# Altium project PCB_CMV.PrjPCB
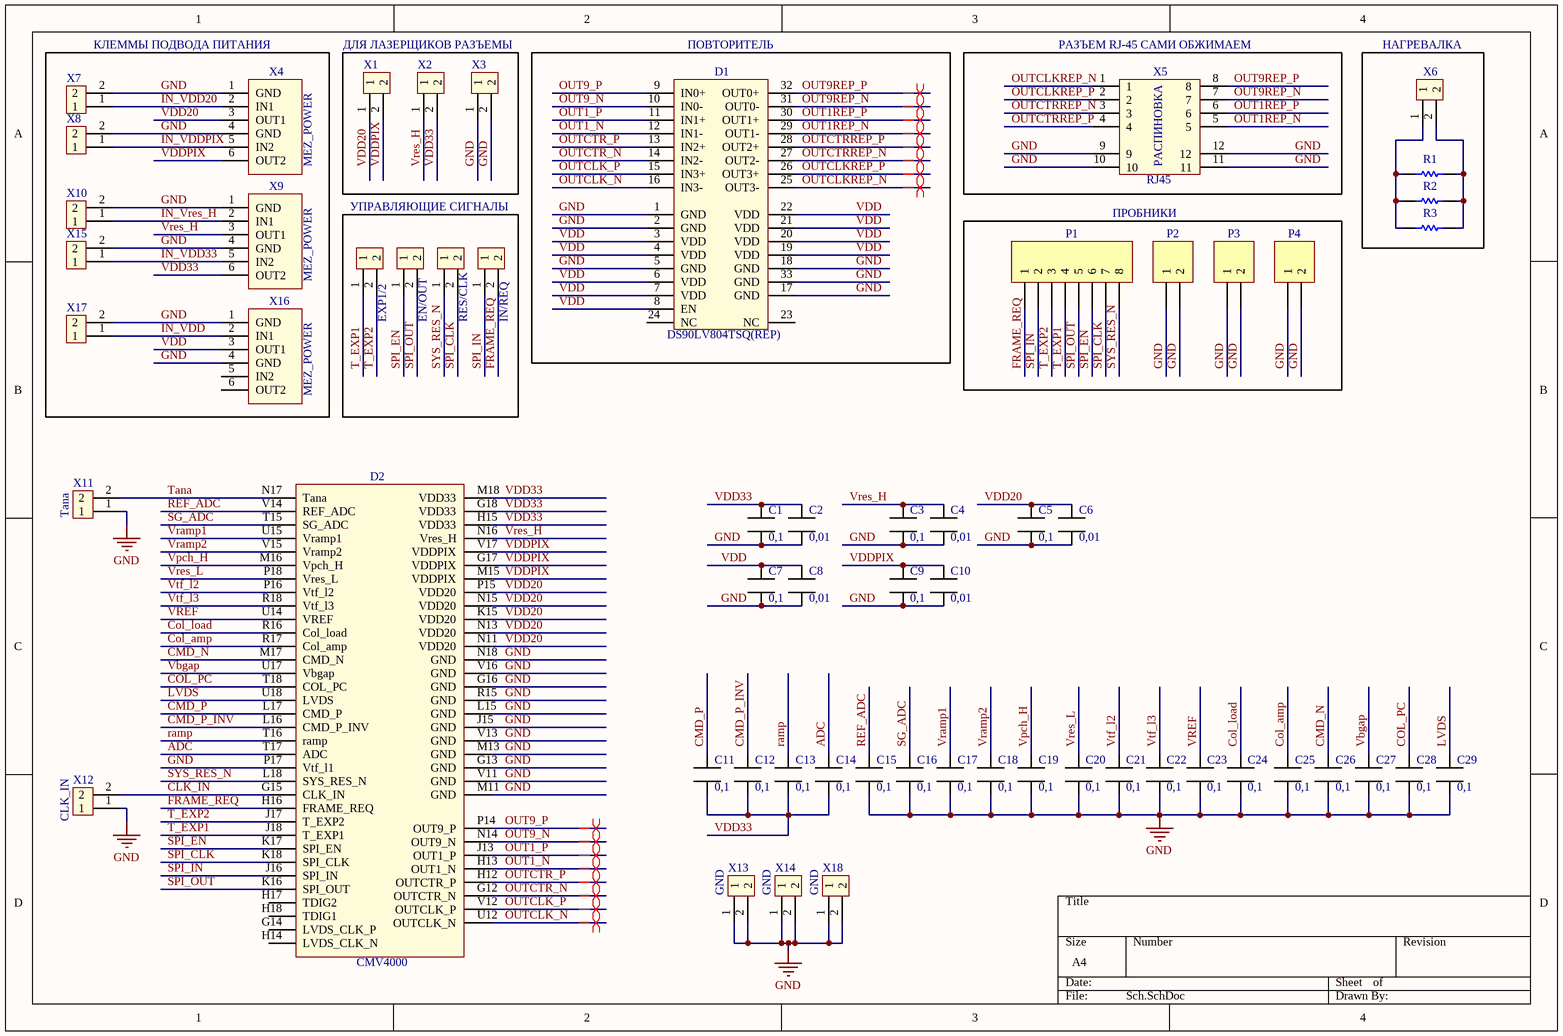
[diagram p0: Sch.SchDoc]
1 sheet, 60 parts. Net scope: global (net labels, ports and power ports of the same name join across sheets).
Board file: CMV.PcbDoc

## Sheet Sch.SchDoc
size A4

### Parts
C1  0,1  [CAP_SMALL]
C2  0,01  [CAP_SMALL]
C3  0,1  [CAP_SMALL]
C4  0,01  [CAP_SMALL]
C5  0,1  [CAP_SMALL]
C6  0,01  [CAP_SMALL]
C7  0,1  [CAP_SMALL]
C8  0,01  [CAP_SMALL]
C9  0,1  [CAP_SMALL]
C10  0,01  [CAP_SMALL]
C11  0,1  [CAP_SMALL]
C12  0,1  [CAP_SMALL]
C13  0,1  [CAP_SMALL]
C14  0,1  [CAP_SMALL]
C15  0,1  [CAP_SMALL]
C16  0,1  [CAP_SMALL]
C17  0,1  [CAP_SMALL]
C18  0,1  [CAP_SMALL]
C19  0,1  [CAP_SMALL]
C20  0,1  [CAP_SMALL]
C21  0,1  [CAP_SMALL]
C22  0,1  [CAP_SMALL]
C23  0,1  [CAP_SMALL]
C24  0,1  [CAP_SMALL]
C25  0,1  [CAP_SMALL]
C26  0,1  [CAP_SMALL]
C27  0,1  [CAP_SMALL]
C28  0,1  [CAP_SMALL]
C29  0,1  [CAP_SMALL]
D1  DS90LV804TSQ(REP)  [DS90LV804TSQ]
D2  CMV4000  [SOCKET_AM2]
EN/OUT  KL_2  [KLEMMNIK_2]  (value not drawn)
EXP1/2  KL_2  [KLEMMNIK_2]  (value not drawn)
IN/REQ  KL_2  [KLEMMNIK_2]  (value not drawn)
P1  Header 8  [HDR1X8]  (value not drawn)
P2  Header 2  [HDR1X2]  (value not drawn)
P3  Header 2  [HDR1X2]  (value not drawn)
P4  Header 2  [HDR1X2]  (value not drawn)
R1  Res Semi  [AXIAL-0.5]  (value not drawn)
R2  Res Semi  [AXIAL-0.5]  (value not drawn)
R3  Res Semi  [AXIAL-0.5]  (value not drawn)
RES/CLK  KL_2  [KLEMMNIK_2]  (value not drawn)
X1  KL_2  [KLEMMNIK_2]  (value not drawn)
X2  KL_2  [KLEMMNIK_2]  (value not drawn)
X3  KL_2  [KLEMMNIK_2]  (value not drawn)
X4  MEZ_POWER  [MEZON_POWER_NEW]
X5  RJ45  [RJ45]
X6  KL_2  [KLEMMNIK_2]  (value not drawn)
X7  KL_2  [KLEMMNIK_2]  (value not drawn)
X8  KL_2  [KLEMMNIK_2]  (value not drawn)
X9  MEZ_POWER  [MEZON_POWER_NEW]
X10  KL_2  [KLEMMNIK_2]  (value not drawn)
X11  Tana  [KLEMMNIK_2]
X12  CLK_IN  [KLEMMNIK_2]
X13  GND  [KLEMMNIK_2]
X14  GND  [KLEMMNIK_2]
X15  KL_2  [KLEMMNIK_2]  (value not drawn)
X16  MEZ_POWER  [MEZON_POWER_NEW]
X17  KL_2  [KLEMMNIK_2]  (value not drawn)
X18  GND  [KLEMMNIK_2]

### Blocks framed on the sheet
КЛЕММЫ ПОДВОДА ПИТАНИЯ: X4 X7-X10 X15-X17
ДЛЯ ЛАЗЕРЩИКОВ РАЗЪЕМЫ: X1-X3
ПОВТОРИТЕЛЬ: D1
РАЗЪЕМ RJ-45 САМИ ОБЖИМАЕМ: X5
НАГРЕВАЛКА: R1-R3 X6
УПРАВЛЯЮЩИЕ СИГНАЛЫ: EN/OUT EXP1/2 IN/REQ RES/CLK
ПРОБНИКИ: P1-P4

### Nets
GND: C1.1 C2.1 C3.1 C4.1 C5.1 C6.1 C7.1 C8.1 C9.1 C10.1 C15.1 C16.1 C17.1 C18.1 C19.1 C20.1 C21.1 C22.1 C23.1 C24.1 C25.1 C26.1 C27.1 C28.1 C29.1 D1.1(GND) D1.2(GND) D1.5(GND) D1.17(GND) D1.18(GND) D1.33(GND) D2.G13(GND) D2.G16(GND) D2.J15(GND) D2.L15(GND) D2.M11(GND) D2.M13(GND) D2.N18(GND) D2.P17(Vtf_l1) D2.R15(GND) D2.V11(GND) D2.V13(GND) D2.V16(GND) P2.1 P2.2 P3.1 P3.2 P4.1 P4.2 X3.1 X3.2 X4.1(GND) X4.4(GND) X5.9 X5.10 X5.11 X5.12 X7.2 X8.2 X9.1(GND) X9.4(GND) X10.2 X11.1 X12.1 X13.1 X13.2 X14.1 X14.2 X15.2 X16.1(GND) X16.4(GND) X17.2 X18.1 X18.2
ADC: C14.2 D2.T17(ADC)
CLK_IN: D2.G15(CLK_IN) X12.2
CMD_N: C26.2 D2.M17(CMD_N)
CMD_P: C11.2 D2.L17(CMD_P)
CMD_P_INV: C12.2 D2.L16(CMD_P_INV)
Col_amp: C25.2 D2.R17(Col_amp)
Col_load: C24.2 D2.R16(Col_load)
COL_PC: C28.2 D2.T18(COL_PC)
FRAME_REQ: D2.H16(FRAME_REQ) IN/REQ.2 P1.1
IN_VDD: X16.2(IN1) X17.1
IN_VDD20: X4.2(IN1) X7.1
IN_VDD33: X9.5(IN2) X15.1
IN_VDDPIX: X4.5(IN2) X8.1
IN_Vres_H: X9.2(IN1) X10.1
LVDS: C29.2 D2.U18(LVDS)
OUT1_N: D1.12(IN1-) D2.H13(OUT1_N)
OUT1_P: D1.11(IN1+) D2.J13(OUT1_P)
OUT1REP_N: D1.29(OUT1-) X5.5
OUT1REP_P: D1.30(OUT1+) X5.6
OUT9_N: D1.10(IN0-) D2.N14(OUT9_N)
OUT9_P: D1.9(IN0+) D2.P14(OUT9_P)
OUT9REP_N: D1.31(OUT0-) X5.7
OUT9REP_P: D1.32(OUT0+) X5.8
OUTCLK_N: D1.16(IN3-) D2.U12(OUTCLK_N)
OUTCLK_P: D1.15(IN3+) D2.V12(OUTCLK_P)
OUTCLKREP_N: D1.25(OUT3-) X5.1
OUTCLKREP_P: D1.26(OUT3+) X5.2
OUTCTR_N: D1.14(IN2-) D2.G12(OUTCTR_N)
OUTCTR_P: D1.13(IN2+) D2.H12(OUTCTR_P)
OUTCTRREP_N: D1.27(OUT2-) X5.3
OUTCTRREP_P: D1.28(OUT2+) X5.4
ramp: C13.2 D2.T16(ramp)
REF_ADC: C15.2 D2.V14(REF_ADC)
SG_ADC: C16.2 D2.T15(SG_ADC)
SPI_CLK: D2.K18(SPI_CLK) P1.7 RES/CLK.2
SPI_EN: D2.K17(SPI_EN) EN/OUT.1 P1.6
SPI_IN: D2.J16(SPI_IN) IN/REQ.1 P1.2
SPI_OUT: D2.K16(SPI_OUT) EN/OUT.2 P1.5
SYS_RES_N: D2.L18(SYS_RES_N) P1.8 RES/CLK.1
T_EXP1: D2.J18(T_EXP1) EXP1/2.1 P1.4
T_EXP2: D2.J17(T_EXP2) EXP1/2.2 P1.3
Tana: D2.N17(Tana) X11.2
Vbgap: C27.2 D2.U17(Vbgap)
VDD: C7.2 C8.2 D1.3(VDD) D1.4(VDD) D1.6(VDD) D1.7(VDD) D1.8(EN) D1.19(VDD) D1.20(VDD) D1.21(VDD) D1.22(VDD) X16.3(OUT1)
VDD20: C5.2 C6.2 D2.K15(VDD20) D2.N11(VDD20) D2.N13(VDD20) D2.N15(VDD20) D2.P15(VDD20) X1.1 X4.3(OUT1)
VDD33: C1.2 C2.2 C11.1 C12.1 C13.1 C14.1 D2.G18(VDD33) D2.H15(VDD33) D2.M18(VDD33) X2.2 X9.6(OUT2)
VDDPIX: C9.2 C10.2 D2.G17(VDDPIX) D2.M15(VDDPIX) D2.V17(VDDPIX) X1.2 X4.6(OUT2)
Vpch_H: C19.2 D2.M16(Vpch_H)
Vramp1: C17.2 D2.U15(Vramp1)
Vramp2: C18.2 D2.V15(Vramp2)
VREF: C23.2 D2.U14(VREF)
Vres_H: C3.2 C4.2 D2.N16(Vres_H) X2.1 X9.3(OUT1)
Vres_L: C20.2 D2.P18(Vres_L)
Vtf_l2: C21.2 D2.P16(Vtf_l2)
Vtf_l3: C22.2 D2.R18(Vtf_l3)
NetR1_1: R1.1 R2.1 R3.1 X6.1
NetR1_2: R1.2 R2.2 R3.2 X6.2

Not connected (* = marked no-connect by the designer): D1 23(NC) 24(NC); D2 G14(LVDS_CLK_P) H14(LVDS_CLK_N) H17(TDIG2) H18(TDIG1); X16 5(IN2) 6(OUT2)

### Layout directives
differential pair: OUT1_N, OUT1_P, OUT1REP_N, OUT1REP_P, OUT9_N, OUT9_P, OUT9REP_N, OUT9REP_P, OUTCLK_N, OUTCLK_P, OUTCLKREP_N, OUTCLKREP_P, OUTCTR_N, OUTCTR_P, OUTCTRREP_N, OUTCTRREP_P

### Notes on the sheet
- (in symbol RJ45) РАСПИНОВКА

### Library data of the parts
C1-C29 = CAP_SMALL
D1 = DS90LV804TSQ
EN/OUT EXP1/2 IN/REQ RES/CLK X1-X3 X6-X8 X10-X15 X17 X18 = KLEMMNIK_2
P1 = Header 8: Header, 8-Pin; LatestRevisionDate: 17-Jul-2002; LatestRevisionNote: Re-released for DXP Platform.; Publisher: Altium Limited
P2-P4 = Header 2: Header, 2-Pin; LatestRevisionDate: 17-Jul-2002; LatestRevisionNote: Re-released for DXP Platform.; Publisher: Altium Limited
R1-R3 = Res Semi: Semiconductor Resistor; Value: 1K; Published: 8-Jun-2000; LatestRevisionDate: 17-Jul-2002; LatestRevisionNote: Re-released for DXP Platform.; PackageReference: AXIAL-0.5; Publisher: Altium Limited; PackageDescription: Axial Device, Thru-Hole; 2 Leads; 0.5 in Pin Spacing
X4 X9 X16 = MEZON_POWER_NEW